# EAGLE design CV_Makers_Oximeter_v0 (EAGLE 9.5.2)
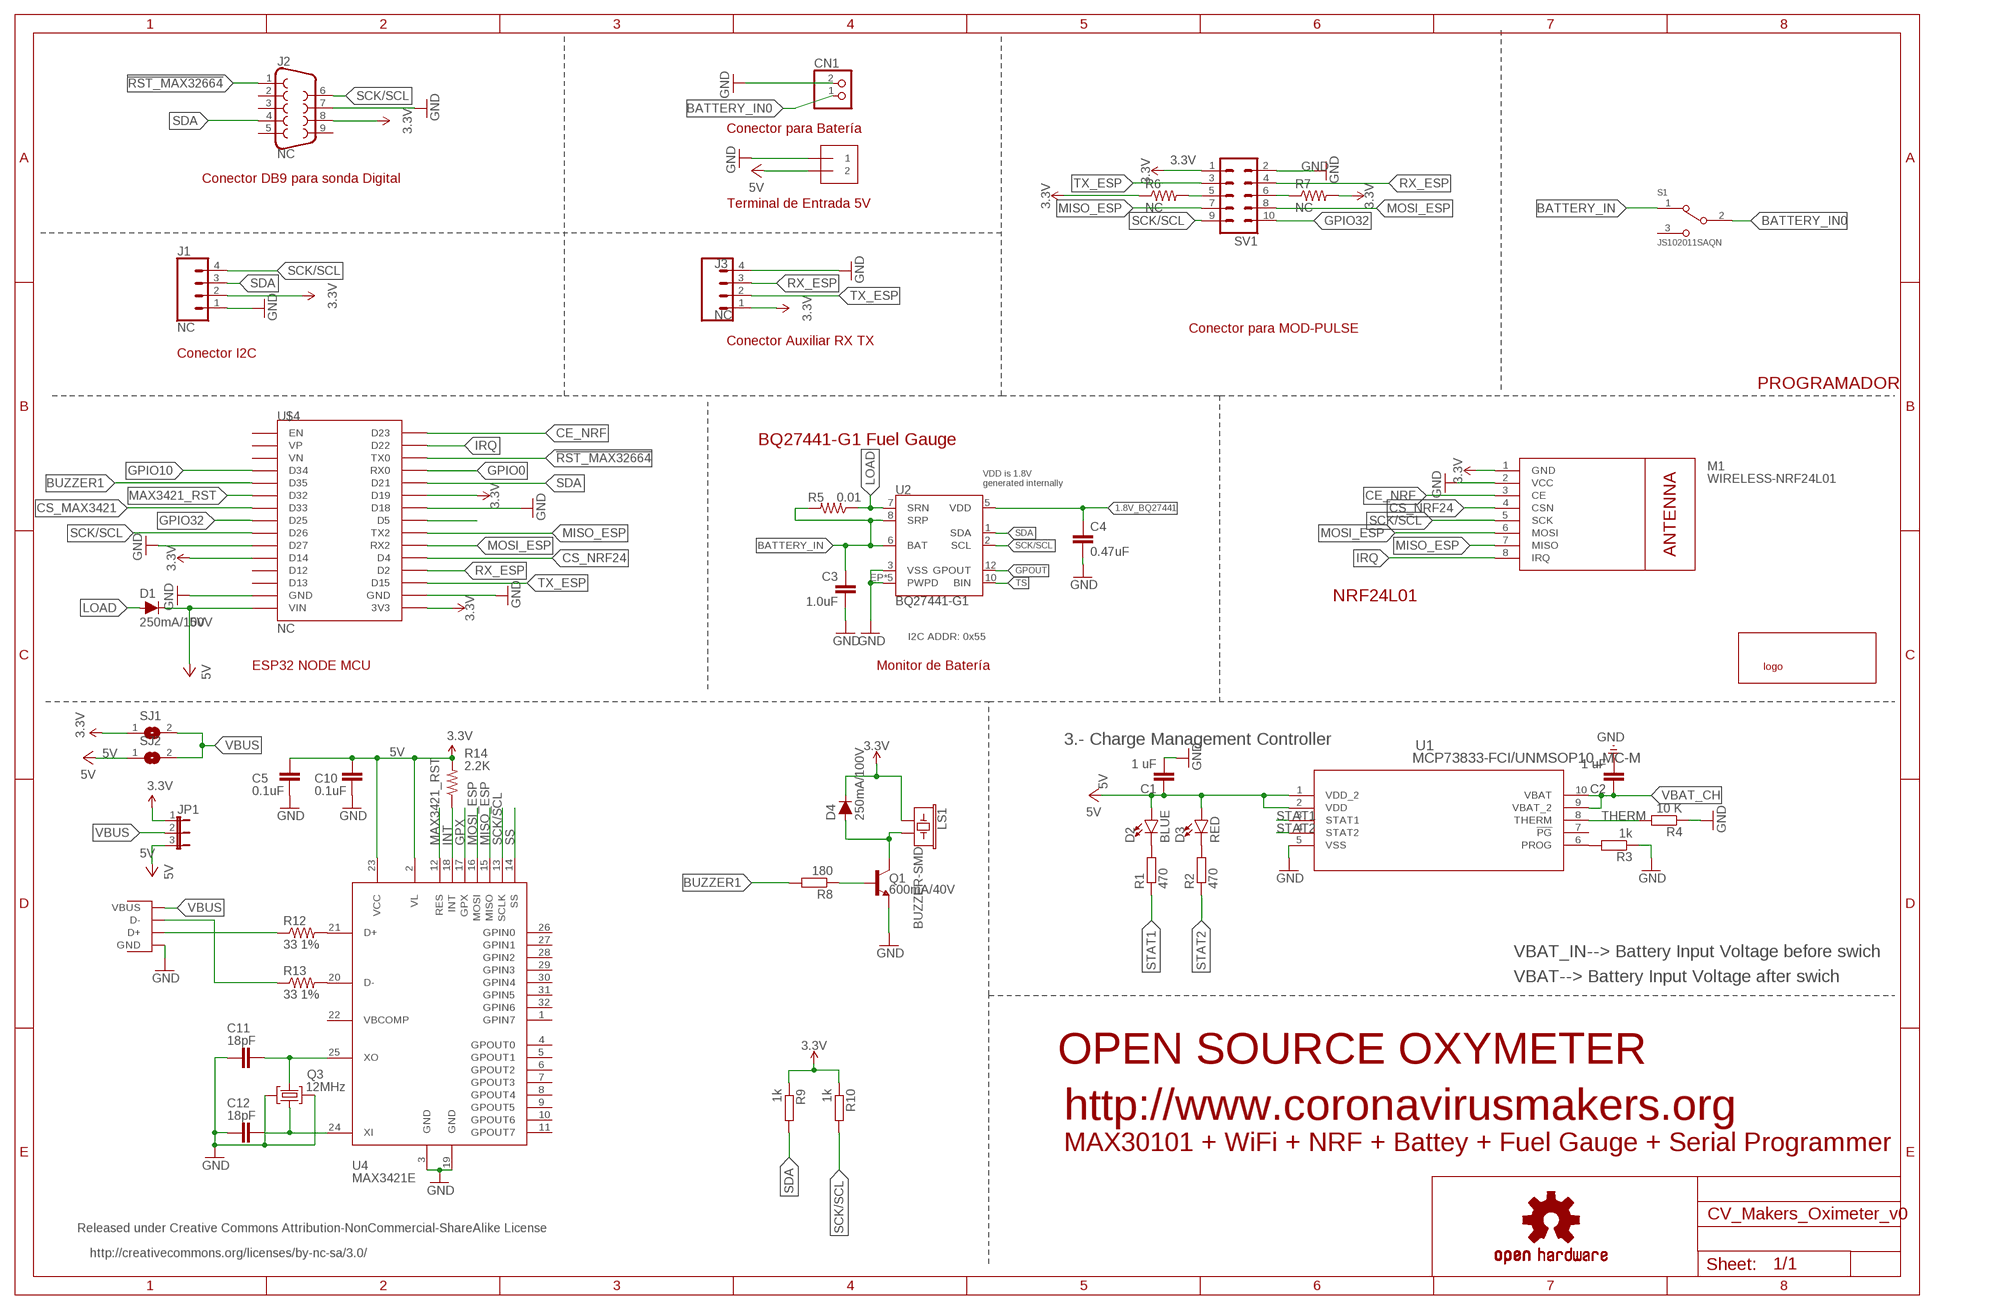
[diagram p0: schematic, sheet 1]

## Parts
C1  1 uF  C-EUC0603  [C0603]
C2  1 uF  C-EUC0603  [C0603]
C3  1.0uF  1.0UF-16V-10%(0603)  [0603-CAP]
C4  0.47uF  CAP0603-CAP  [0603-CAP]
C5  0.1uF  CAP0603  [0603]
C10  0.1uF  CAP0603  [0603]
C11  18pF  CAP0603  [0603]
C12  18pF  CAP0603  [0603]
CN1  JST_2PIN-THM-RA  [JST-PH-2-THM-RA]
D1  250mA/100V  DIODE-BAS16J  [SOD-323]
D2  BLUE  LED-BLUE0603  [LED-0603]
D3  RED  LED-RED0603  [LED-0603]
D4  250mA/100V  DIODE-BAS16J  [SOD-323]
J1  NC  CONN_04  [1X04]
J2  NC  DB9FEMALE  [DB9]
J3  NC  CONN_04  [1X04]
J4  NC  1X2-3.5MM  [1X2-3.5MM]
JP1  JP2E  [JP2]
LOGO1  OSHW-LOGOL-COPPER  [OSHW-LOGO-L_COPPER]
LS1  BUZZER-SMD  [BUZZER-CCV]
M1  WIRELESS-NRF24L01  [WIRELESS-NRF24L01]
Q1  600mA/40V  TRANS_NPN-MMBT2222AL  [SOT23-3]
Q3  12MHz  CRYSTAL_SH  [CRYSTAL-SMD-5X3]
R1  470  R-EU_R0603  [R0603]
R2  470  R-EU_R0603  [R0603]
R3  1k  R-EU_R0603  [R0603]
R4  10 K  R-EU_R0603  [R0603]
R5  0.01  RESISTOR1206  [1206]
R6  NC  R-US_R0603  [R0603]
R7  NC  R-US_R0603  [R0603]
R8  180  R-EU_R0603  [R0603]
R9  1k  R-EU_R0603  [R0603]
R10  1k  R-EU_R0603  [R0603]
R12  33 1%  RESISTOR0603  [0603]
R13  33 1%  RESISTOR0603  [0603]
R14  2.2K  RESISTOR0603  [0603]
S1  JS102011SAQN  [SW_JS102011SAQN]
SJ1  SJ  [SJ]
SJ2  SJ  [SJ]
SV1  ML10  [ML10]
U1  MCP73833-FCI/UNMSOP10_MC-M  [MSOP10_MC-M]
U2  BQ27441-G1  [PDSO-N12]
U4  MAX3421E  [TQFP32_8MIL]
U$2  LOGOEU  [LOGO2]
U$4  NC  ESP32_DEVKIT  [ESP32_DEVKIT]
X2  USB-A-H  [USB-A-H]

## Nets
1.8V_BQ27441: C4.1 U2.5(VDD)
3.3V: D4.C J1.2 J2.8 J3.1 JP1.1 LS1.+ M1.1(GND) R6.1 R7.2 R9.1 R10.1 SJ1.1 SV1.1 U$4.D14 U$4.D19
5V [VCC]: C1.1 C5.1 C10.1 D1.C D2.A D3.A J4.2 JP1.3 R14.2 SJ2.1 U1.1(VDD_2) U1.2(VDD) U4.2(VL) U4.23(VCC) U$4.VIN ; supply symbol labelled 3.3V
!RST_MAX32664: J2.1 U$4.TX0
BATTERY_IN: C3.1 R5.2 S1.1 U2.6(BAT) U2.8(SRP)
BATTERY_IN0: CN1.1 S1.2
BUZZER1: R8.2 U$4.D35
CE_NRF: M1.3(CE) U$4.D23
CS_MAX3421: U$4.D33
CS_NRF24: M1.4(CSN) U$4.D4
GND [GND]: C1.2 C2.2 C3.2 C4.2 C5.2 C10.2 C11.1 C12.1 CN1.2 J1.1 J2.7 J3.4 J4.1 M1.2(VCC) Q1.2(E) Q3.2 Q3.4 R3.1 R4.1 SV1.2 U1.5(VSS) U2.3(VSS) U2.EP1(PWPD) U2.EP2(PWPD) U2.EP3(PWPD) U2.EP4(PWPD) U2.EP(PWPD) U4.3(GND) U4.19(GND) U$4.D18 U$4.GND@1(GND) X2.GND
GPIO0: U$4.RX0
GPIO10: U$4.D34
GPIO32: SV1.10 U$4.D25
GPOUT: U2.12(GPOUT)
GPX: U4.17(GPX)
INT: R14.1 U4.18(INT)
IRQ: M1.8(IRQ) U$4.D22
LOAD: D1.A R5.1 U2.7(SRN)
MAX3421_RST: U4.12(RES) U$4.D32
MISO_ESP: M1.7(MISO) SV1.7 U4.15(MISO) U$4.TX2
MOSI_ESP: M1.6(MOSI) SV1.8 U4.16(MOSI) U$4.RX2
N$1: U$4.3V3 ; supply symbol labelled 3.3V
N$2: R6.2 SV1.5
N$3: R7.1 SV1.6
N$4: U$4.D27 ; supply symbol labelled GND
N$5: U$4.GND@2(GND) ; supply symbol labelled GND
N$6: Q1.1(B) R8.1
N$7: D4.A LS1.- Q1.3(C)
N$9: U$4.D5
N$10: R12.2 U4.21(D+)
N$11: D3.C R2.2
N$12: R13.2 U4.20(D-)
N$14: D2.C R1.2
N$15: R3.2 U1.6(PROG)
N$17: C11.2 Q3.3 U4.25(XO)
N$18: C12.2 Q3.1 U4.24(XI)
N$19: R12.1 X2.D+
N$20: R13.1 X2.D-
RX_ESP: J3.3 SV1.4 U$4.D2
SCK/SCL: J1.4 J2.6 M1.5(SCK) R10.2 SV1.9 U2.2(SCL) U4.13(SCLK) U$4.D26
SDA: J1.3 J2.4 R9.2 U2.1(SDA) U$4.D21
SS: U4.14(SS)
STAT1: R1.1 U1.3(STAT1)
STAT2: R2.1 U1.4(STAT2)
THERM: R4.2 U1.8(THERM)
TS: U2.10(BIN)
TX_ESP: J3.2 SV1.3 U$4.D15
VBAT_CH: C2.1 U1.9(VBAT_2) U1.10(VBAT)
VBUS: JP1.2 SJ1.2 SJ2.2 X2.VBUS
Unconnected: J2.2 J2.3 J2.5 J2.9 S1.3 U1.7(!PG) U4.1(GPIN7) U4.4(GPOUT0) U4.5(GPOUT1) U4.6(GPOUT2) U4.7(GPOUT3) U4.8(GPOUT4) U4.9(GPOUT5) U4.10(GPOUT6) U4.11(GPOUT7) U4.22(VBCOMP) U4.26(GPIN0) U4.27(GPIN1) U4.28(GPIN2) U4.29(GPIN3) U4.30(GPIN4) U4.31(GPIN5) U4.32(GPIN6) U$4.D12 U$4.D13 U$4.EN U$4.VN U$4.VP

## Notes on the sheet
- Conector para Batería
- Conector DB9 para sonda Digital
- Terminal de Entrada 5V
- Conector para MOD-PULSE
- Conector Auxiliar RX TX
- Conector I2C
- PROGRAMADOR
- BQ27441-G1 Fuel Gauge
- VDD is 1.8V
  generated internally
- NRF24L01
- I2C ADDR: 0x55
- ESP32 NODE MCU | Monitor de Batería
- 3.- Charge Management Controller
- VBAT_IN--> Battery Input Voltage before swich
- VBAT--> Battery Input Voltage after swich
- OPEN SOURCE OXYMETER
- http://www.coronavirusmakers.org
- MAX30101 + WiFi + NRF + Battey + Fuel Gauge + Serial Programmer
- Released under Creative Commons Attribution-NonCommercial-ShareAlike License
- http://creativecommons.org/licenses/by-nc-sa/3.0/

## Library data of the parts
C1 C2 = rcl:C-EU: CAPACITOR, European symbol
C3 = SparkFun-Capacitors:1.0UF-16V-10%(0603): CAP-00868; PROD_ID: CAP-00868
C4 = SparkFun-Capacitors:CAP: Capacitor Standard 0603 ceramic capacitor, and 0.1" leaded capacitor.; PROD_ID: CAP-13216
C5 C10-C12 = CH_passive:CAP: Capacitor Standard 0603 ceramic capacitor, and 0.1" leaded capacitor.
CN1 = adafruit:JST_2PIN: JST 2-Pin Connectors of various flavors SMT-RA (S2B-PH-SM4) 4UConnector #17311 SMT (B2B-PH-SM4) THM-RA (S2B-PH) THM (B2B-PH)
D1 D4 = SparkFun-DiscreteSemi:DIODE: Diode These are standard reverse protection diodes and small signal diodes. SparkFun Products: SparkFun SparkPunk Sound Kit <https://www.sparkfun.com/products/11177> SparkFun ESP8266 Thing <https://www.sparkfun.com/products/13231>; PROD_ID: DIO-09646
D2 = SparkFun-LED:LED-BLUE: Blue SMD LED Used in manufacturing of various products at SparkFun Packages: 0603 - SMD 0603 package [Product Link] <http://www.digikey.com/product-detail/en/SMLE12BC7TT86/511-1589-2-ND/1641808> 1206 - SMD1206 package [Product Link] <http://www.digikey.com/product-detail/en/lite-on-inc/LTST-C150TBKT/160-1643-1-ND/573584> SparkFun Products: ESP8266 Thing-Dev Board <https://www.sparkfun.com/products/13711> RedBoard <https://www.sparkfun.com/products/12757>; PROD_ID: DIO-08575
D3 = SparkFun-LED:LED-RED: Red SMD LED Used in manufacturing of most products at SparkFun Packages: 0603 - SMD 0603 package [Product Link] <http://docs.avagotech.com/docs/AV02-0551EN> 0603 SMART - SMD 0603 SMART package ( more efficient and expensive)[Product Link] <http://www.osram-os.com/Graphics/XPic2/00077099_0.pdf> 1206 - SMD1206 package [Product Link] <https://www.sparkfun.com/datasheets/DevTools/LilyPad/Q150OVS4.pdff> SparkFun Products: Pro Mini 328 -5V <https://www.sparkfun.com/products/821> RedBoard <https://www.sparkfun.com/products/12757> IOIO-OTG <https://www.sparkfun.com/products/13613>; PROD_ID: DIO-00819
J1 J3 = SparkFun-Connectors:CONN_04: Multi connection point. Often used as Generic Header-pin footprint for 0.1 inch spaced/style header connections On any of the 0.1 inch spaced packages, you can populate with these: Break Away Headers - Straight <https://www.sparkfun.com/products/116> (PRT-00116) Break Away Male Headers - Right Angle <https://www.sparkfun.com/products/553> (PRT-00553) Female Headers <https://www.sparkfun.com/products/115> (PRT-00115) Break Away Headers - Machine Pin <https://www.sparkfun.com/products/117> (PRT-00117) Break Away Female Headers - Swiss Machine Pin <https://www.sparkfun.com/products/743> (PRT-00743) For SCREWTERMINALS and SPRING TERMINALS visit here: Screw Terimnals on SparkFun.com <https://www.sparkfun.com/search/results?term=Screw+Terminals> (5mm/3.5mm/2.54mm spacing) This device is also useful as a general connection point to wire up your design to another part of your project. Our various solder wires solder well into these plated through hole pads. Hook-Up Wire - Assortment (Stranded, 22 AWG) <https://www.sparkfun.com/products/11375> (PRT-11375) Hook-Up Wire - Assortment (Solid Core, 22 AWG) <https://www.sparkfun.com/products/11367> (PRT-11367) View the entire wire category on our website here <https://www.sparkfun.com/categories/141> Special notes: Molex polarized connector foot print use with SKU : PRT-08231 with associated crimp pins and housings. 1MM SMD Version SKU: PRT-10208; PROD_ID: CONN-09696
J2 = SparkFun-Connectors:DB9: DB9 Connector Standard DB9 (D-Sub 9) serial connector. Can be used for CAN bus as well as RS485 and RS232. Footprint production proven. Here is the female version connector we sell at SparkFun: 9 Pin Female Serial Connector - PCB Mount <https://www.sparkfun.com/products/429> (PRT-00429) This connector has been used on the following SparkFun products: SparkFun RS232 Shifter - SMD <https://www.sparkfun.com/products/449> (PRT-00449) SparkFun RS232 Shifter SMD (No DB9) <https://www.sparkfun.com/products/8780> (PRT-08780); PROD_ID: CONN-08194
J4 = adafruit:1X2: 3.5mm Terminal block http://www.ladyada.net/library/pcb/eaglelibrary.html
JP1 = jumper:JP2E: JUMPER
LOGO1 = SparkFun-Aesthetics:OSHW-LOGO: Open-Source Hardware (OSHW) Logo This logo indicates the piece of hardware it is found on incorporates a OSHW license and/or adheres to the definition of open source hardware found here: http://freedomdefined.org/OSHW
LS1 = SparkFun-Electromechanical:BUZZER: Buzzer Small round buzzers that operate around the audible 2kHz range. You can use these as speakers to create simple music or user interfaces. Variant Overview: PTH - Mini Speaker - PC Mount 12mm 2.048kHz <https://www.sparkfun.com/products/7950> PTH_KIT - Mini Speaker - PC Mount 12mm 2.048kHz <https://www.sparkfun.com/products/7950> KIT simplifies soldering by adding stop mask to one side of the pads. PTH_NO_SILK - Mini Speaker - PC Mount 12mm 2.048kHz <https://www.sparkfun.com/products/7950> No silkscreen indicator of buzzer outline. PTH_KIT_NO_SILK - Mini Speaker - PC Mount 12mm 2.048kHz <https://www.sparkfun.com/products/7950> KIT package w/o silkscreen SMD - Buzzer Audio Magnetic (CCV-084B16) SMD buzzer used on, e.g. the LilyPad Buzzer <https://www.sparkfun.com/products/8463> and RFID USB Reader <https://www.sparkfun.com/products/9963>. SMD_KIT - Buzzer Audio Magnetic (CCV-084B16) SMD Buzzer with elongated pins to make soldering easier. Used on the SparkFun Simon Says - Surface Mount Soldering Kit <https://www.sparkfun.com/products/10935>.; PROD_ID: COMP-08568
M1 = diy-modules:WIRELESS-NRF24L01: 2.4 GHz Wireless Module based on NRF24L01 chip More details available here: http://www.electrodragon.com/w/NRF24L01 Click here to find device on ebay.com <http://www.ebay.com/sch/nrf24l01+arduino>
Q1 = SparkFun-DiscreteSemi:TRANS_NPN: NPN transistor Current controlled devices typically used to amplify current or used as a switch. BC547 - COM-08928 <http://www.sparkfun.com/products/8928> (TO-92 45V 100mA) (1.Collector 2.Base 3.Emitter) 2N3904 - COM-00521 <http://www.sparkfun.com/products/521> (TO-92 40V 200mA) (1.Emitter 2.Base 3.Collector) P2N2222A - COM-12852 <http://www.sparkfun.com/products/12852> (TO-92 40V 600mA) (1.Collector 2.Base 3.Emitter); PROD_ID: TRANS-08049
Q3 = CH_passive:CRYSTAL_SH
R1-R4 R8-R10 = rcl:R-EU_: RESISTOR, European symbol
R5 = SparkFun-Resistors:RESISTOR: Generic Resistor Package; PROD_ID: RES-13218
R6 R7 = adafruit:R-US_: RESISTOR, American symbol
R12-R14 = CH_passive:RESISTOR: Resistor Basic schematic elements and footprints for 0603, 1206, and PTH 1/10th watt (small) resistors.
S1 = TFM:JS102011SAQN: JS10 Series SPDT On-On 6 V 0.3 A Gull Wing SMT Slide Switch http://www.snapeda.com/parts/JS102011SAQN/C%26K%20Components/view-part/; AVAILABILITY: Good; DESCRIPTION: JS10 Series SPDT On-On 6 V 0.3 A Gull Wing SMT Slide Switch; MF: C&K Components; MP: JS102011SAQN; PACKAGE: None; PRICE: 0.37 USD
SJ1 SJ2 = jumper:SJ: SMD solder JUMPER
SV1 = con-harting-ml:ML10: HARTING
U1 = TFM:MCP73833-FCI/UN; MANUFACTURER_PART_NUMBER: MCP73833FCIUN; VENDOR: Microchip
U2 = battery-management-temp:BQ27441-G1; PROD_ID: IC-13220
U4 = CH_Maxim:MAX3421E
U$2 = Oxymeter:LOGOEU
U$4 = DOIT_ESP32_DEVKIT:ESP32_DEVKIT: ESP32 DEVKIT BOARD
X2 = CH_connectors:USB: USB Connectors USB-B-PTH is C@H proven USB-A-H is C@H proven

## Net classes
0 default: width 0.254 mm
1 GND: width 0.254 mm
2 VCC: width 0.406 mm

## Board
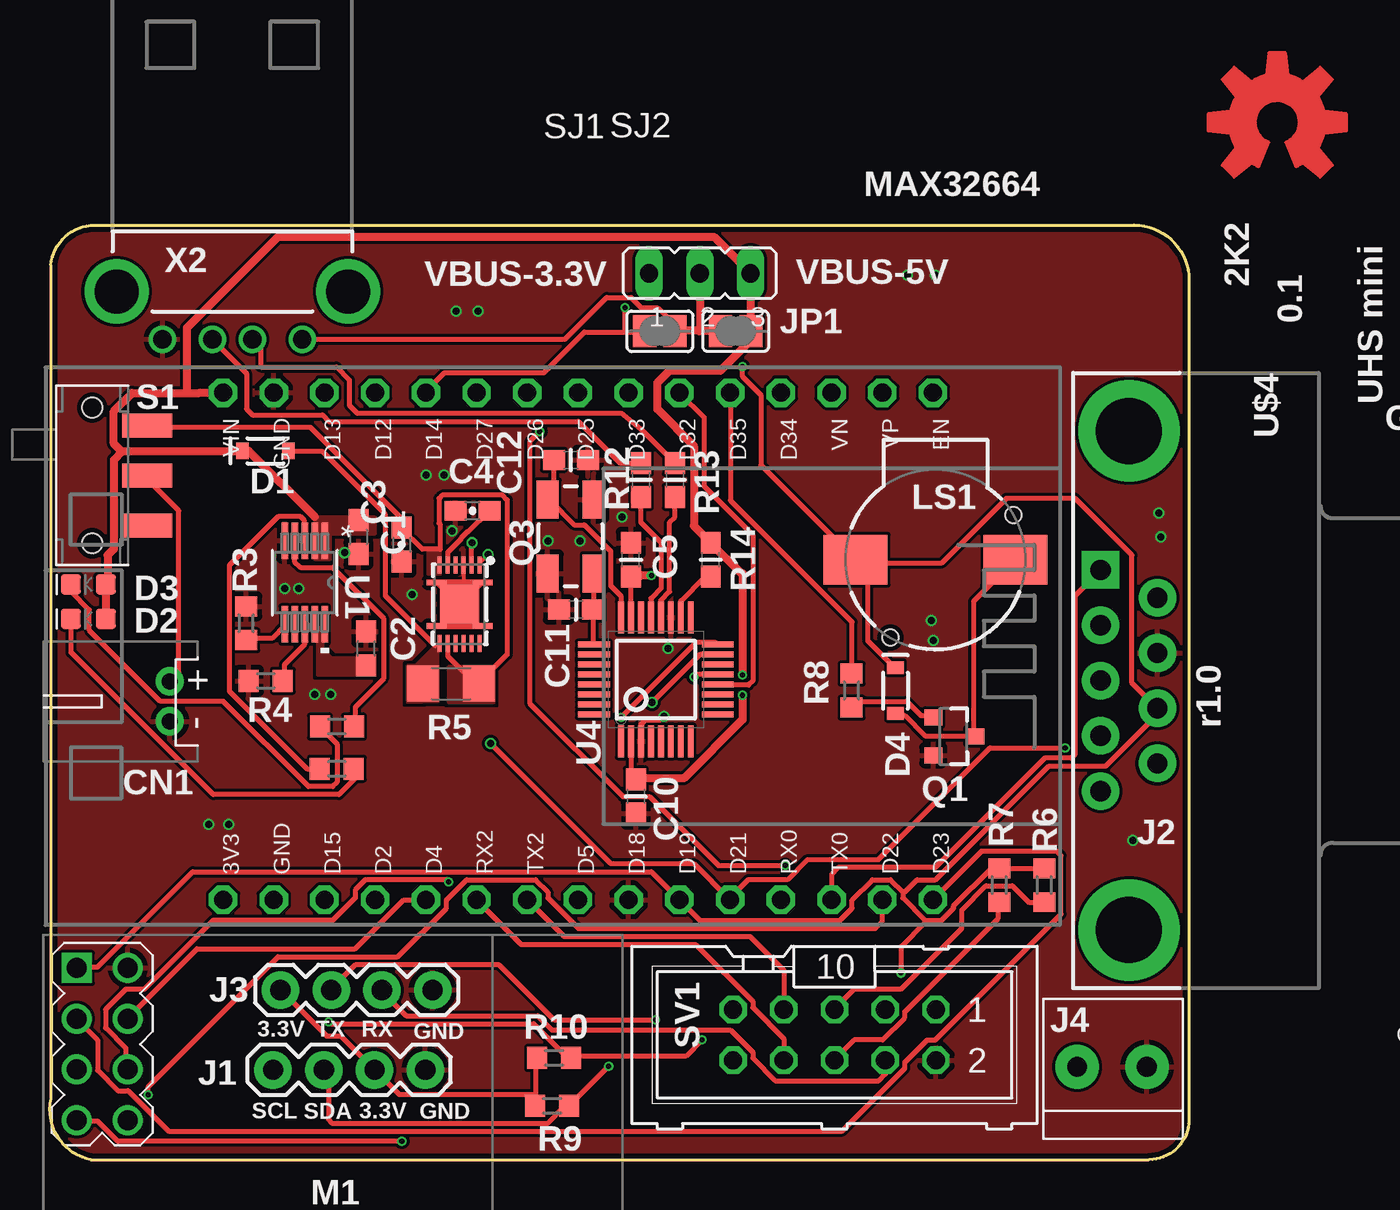
[diagram p1: board, top side]
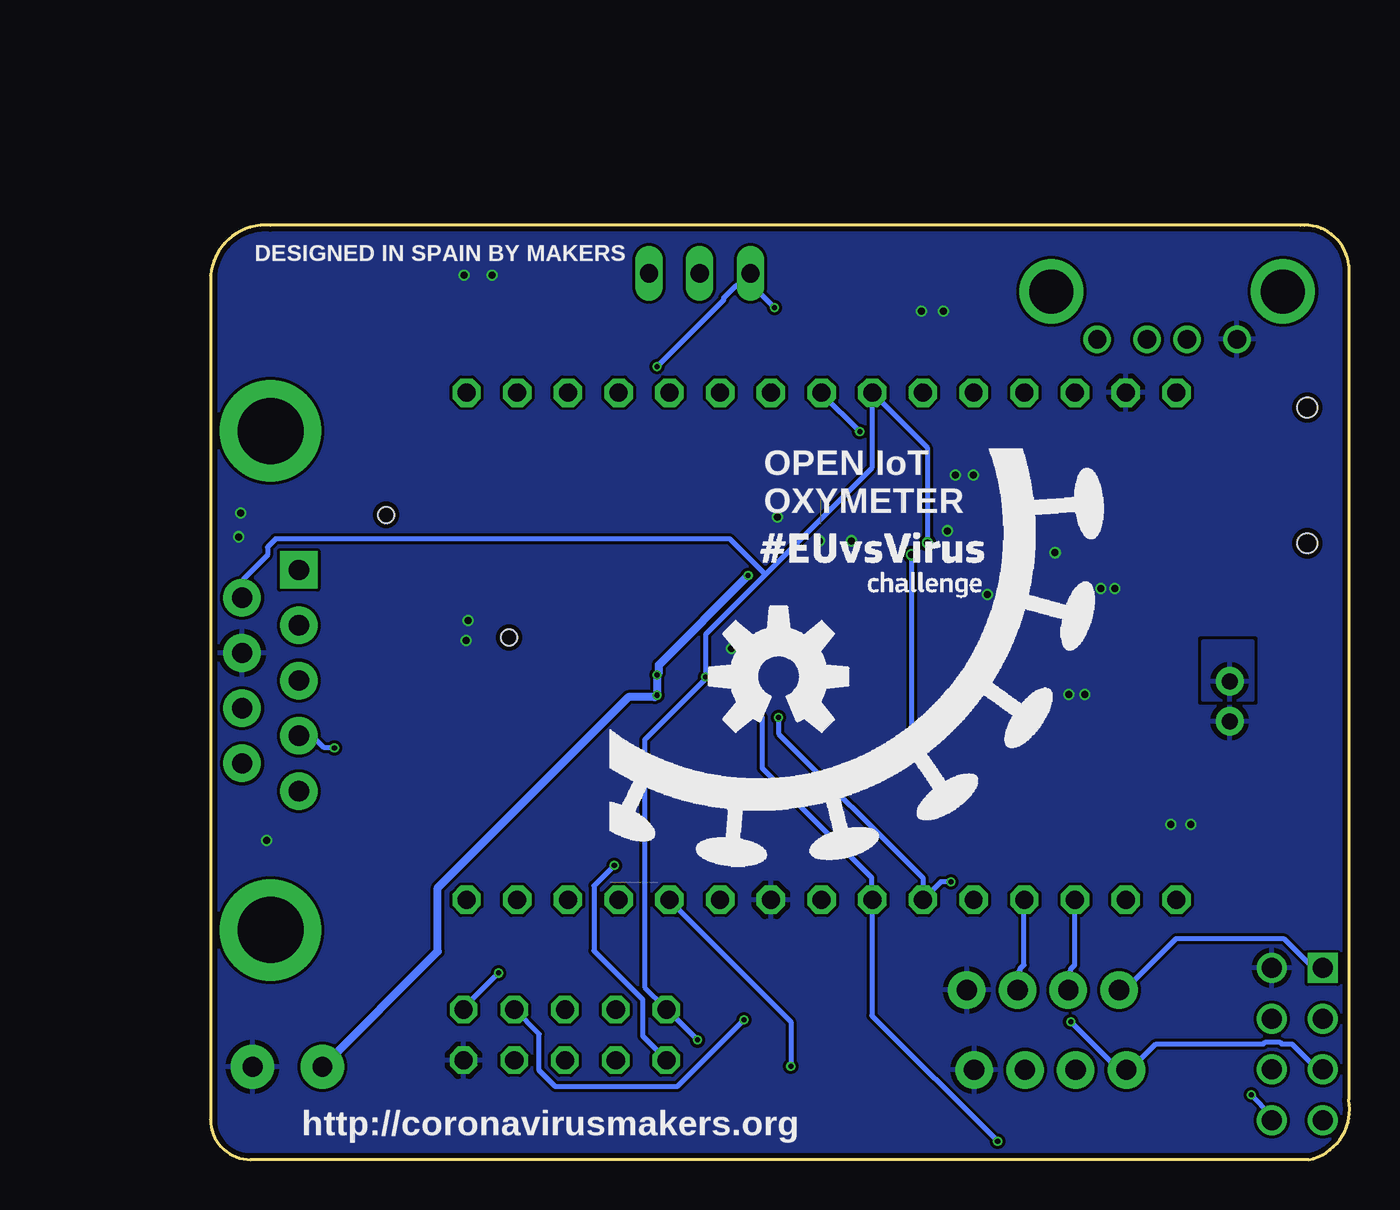
[diagram p2: board, bottom side, seen from below]

Size 57.05 x 46.81 mm. Coordinates in mm from the lower left corner, seen from the top.
Outline: 0.05,44.8 0.05,3 arc90 2.05,0 55.05,0 arc90 57.05,2 57.05,44.3 arc90 54.05,46.8 2.45,46.8 arc90 0.05,44.8
Copper layers (1*16): Top 0.035mm / dielectric 1.5mm / Bottom 0.035mm
Design rules "SeeedStudio_4layer_DRU_no_angle_20140221 *": minimum track width 1mil, minimum drill 10mil, track to track 6mil, track to pad 6mil, pad to pad 6mil, via to via 6mil, smd to smd 0mil, copper to edge 10mil, drill to drill 8mil, minimum pad ring 4mil, minimum via ring 4mil, stop-mask expansion 4mil, vias tented up to drill 25mil, thermal gap 10mil
tRestrict: 2 lines
bRestrict: 2 lines

### Footprints (pad centres in the part's own frame; a part is rotated, then mirrored left to right if it is on the bottom)
C0603 = smd 1.1 x 1: 1 -0.85,0; 2 0.85,0
0603-CAP = smd 1.1 x 1: 1 -0.85,0; 2 0.85,0
0603 = smd 1.1 x 1: 1 -0.85,0; 2 0.85,0
JST-PH-2-THM-RA = drill 0.8 pad 1.422: 1 1,0; 2 -1,0
SOD-323 = smd 0.63 x 0.83: A 1.15,0; C -1.15,0
LED-0603 = smd 1 x 1: A -0.877,0; C 0.877,0
1X04 = drill 1.016 pad 1.88: 1 0,0; 2 2.54,0; 3 5.08,0; 4 7.62,0
DB9 = drill 1.016 pad 1.88 square: 1 -5.54,-1.42 | drill 1.016 pad 1.88: 2 -2.77,-1.42; 3 0,-1.42; 4 2.77,-1.42; 5 5.54,-1.42; 6 -4.15,1.42; 7 -1.38,1.42; 8 1.38,1.42; 9 4.15,1.42 | drill 3.302 pad 5.08: G1 -12.5,0; G2 12.5,0
1X2-3.5MM = drill 1 pad 2.184: 1 1.8,0; 2 -1.7,0
JP2 = drill 0.914 long: 1 -2.54,0; 2 0,0; 3 2.54,0
BUZZER-CCV = smd 3.2 x 2.5: + 4,0; - -4,0 | hole 0.8: -3.9,-2.25; 2.25,3.9
WIRELESS-NRF24L01 = drill 1 square: 1 -12.7,6.35 | drill 1: 2 -10.16,6.35; 3 -12.7,3.81; 4 -10.16,3.81; 5 -12.7,1.27; 6 -10.16,1.27; 7 -12.7,-1.27; 8 -10.16,-1.27
SOT23-3 = smd 0.8 x 0.9: 1 -0.95,-1; 2 0.95,-1; 3 0,1.1
CRYSTAL-SMD-5X3 = smd 1.9 x 1.1: 1 -1.85,-1.15; 2 1.85,-1.15; 3 1.85,1.15; 4 -1.85,1.15
R0603 = smd 1 x 1.1: 1 -0.85,0; 2 0.85,0
1206 = smd 1.6 x 1.8: 1 -1.4,0; 2 1.4,0
SW_JS102011SAQN = smd 1.2 x 2.5: 1 -2.5,2.75; 2 0,2.75; 3 2.5,2.75 | hole 1: -3.4,0; 3.4,0
SJ = smd 1.168 x 1.6: 1 -0.762,0; 2 0.762,0
ML10 = drill 0.914 octagon: 1 -5.08,-1.27; 2 -5.08,1.27; 3 -2.54,-1.27; 4 -2.54,1.27; 5 0,-1.27; 6 0,1.27; 7 2.54,-1.27; 8 2.54,1.27; 9 5.08,-1.27; 10 5.08,1.27
MSOP10_MC-M = smd 1.829 x 0.33: 1 -2.095,1; 2 -2.095,0.5; 3 -2.095,0; 4 -2.095,-0.5; 5 -2.095,-1; 6 2.095,-1; 7 2.095,-0.5; 8 2.095,0; 9 2.095,0.5; 10 2.095,1
PDSO-N12 = smd 0.2 x 0.85: 1 -1,-1.975; 2 -0.6,-1.975; 3 -0.2,-1.975; 4 0.2,-1.975; 5 0.6,-1.975; 6 1,-1.975; 7 1,1.975; 8 0.6,1.975; 9 0.2,1.975; 10 -0.2,1.975; 11 -0.6,1.975; 12 -1,1.975 | smd 1.95 x 1.95: EP 0,0 | smd 1 x 0.25: EP1 -1.15,1.1; EP2 -1.15,-1.1; EP3 1.15,-1.1; EP4 1.15,1.1
TQFP32_8MIL = smd 0.294 x 1.6: 1 -1.75,-3.1; 2 -1.25,-3.1; 3 -0.75,-3.1; 4 -0.25,-3.1; 5 0.25,-3.1; 6 0.75,-3.1; 7 1.25,-3.1; 8 1.75,-3.1; 17 1.75,3.1; 18 1.25,3.1; 19 0.75,3.1; 20 0.25,3.1; 21 -0.25,3.1; 22 -0.75,3.1; 23 -1.25,3.1; 24 -1.75,3.1 | smd 1.6 x 0.294: 9 3.1,-1.75; 10 3.1,-1.25; 11 3.1,-0.75; 12 3.1,-0.25; 13 3.1,0.25; 14 3.1,0.75; 15 3.1,1.25; 16 3.1,1.75; 25 -3.1,1.75; 26 -3.1,1.25; 27 -3.1,0.75; 28 -3.1,0.25; 29 -3.1,-0.25; 30 -3.1,-0.75; 31 -3.1,-1.25; 32 -3.1,-1.75
ESP32_DEVKIT = drill 0.9 pad 1.422 octagon: 3V3 11.43,-17.78; D2 11.43,-10.16; D4 11.43,-7.62; D5 11.43,0; D12 -13.97,-10.16; D13 -13.97,-12.7; D14 -13.97,-7.62; D15 11.43,-12.7; D18 11.43,2.54; D19 11.43,5.08; D21 11.43,7.62; D22 11.43,15.24; D23 11.43,17.78; D25 -13.97,0; D26 -13.97,-2.54; D27 -13.97,-5.08; D32 -13.97,5.08; D33 -13.97,2.54; D34 -13.97,10.16; D35 -13.97,7.62; EN -13.97,17.78; GND@1 -13.97,-15.24; GND@2 11.43,-15.24; RX0 11.43,10.16; RX2 11.43,-5.08; TX0 11.43,12.7; TX2 11.43,-2.54; VIN -13.97,-17.78; VN -13.97,12.7; VP -13.97,15.24
USB-A-H = drill 0.914: D+ 2.4,-1; D- 2.4,1; GND 2.4,-3.5; VBUS 2.4,3.5 | drill 2.2: GND@1 0,5.8; GND@2 0,-5.8

### Placement (x,y rotation side)
C1  15.45,31.19 270 top
C2  15.85,25.6 90 top
C3  17.61,30.81 270 top
C4  21.16,32.5 180 top
C5  29.1,30.05 90 top
C10  29.35,18.19 270 top
C11  26.35,27.55 0 top
C12  26.1,35.05 180 top
CN1  6,22.96 90 top
D1  10.8,35.5 0 top
D2  1.92,27.09 180 top
D3  1.92,28.82 180 top
D4  42.35,23.5 270 top
J1  18.8,4.5 180 top
J2  54.05,24 270 top
J3  11.55,8.5 0 top
J4  53.15,4.65 0 top
JP1  32.55,44.4 0 top
LOGO1  61.47,51.96 0 top  (outside the outline)
LS1  44.35,30.05 180 top
M1  14.05,3.25 0 top
Q1  45.25,21.2 270 top
Q3  26.08,31.22 270 top
R1  14.37,19.58 0 top
R2  14.38,21.7 180 top
R3  9.83,26.87 270 top
R4  10.81,23.98 0 top
R5  20.09,23.84 0 top
R6  49.8,13.75 270 top
R7  47.55,13.75 90 top
R8  40.15,23.5 90 top
R9  25.15,2.7 0 top
R10  25.25,5.1 0 top
R12  29.6,34.05 270 top
R13  31.3,34.05 270 top
R14  33.1,30.05 90 top
S1  2.12,34.27 270 top
SJ1  30.55,41.5 0 top
SJ2  34.35,41.5 180 top
SV1  39.3,6.25 180 top
U1  12.77,28.91 270 top
U2  20.52,27.82 180 top
U4  30.35,24.05 0 top
U$1  [OSHW-LOGO-L]  28.6,24.2 0 bottom
U$2  37.05,14 0 bottom
U$4  26.45,24.45 270 top
X2  9.14,43.49 270 top

### Tracks (layer width: path | path; a pad name or v marks a point on that pad's centre or on a via)
1.8V_BQ27441
  Top 0.254: C4.1 20.97,31.46 20.92,31.46 20.59,31.13 20.59,31.08 19.93,30.42 19.92,30.41 U2.5
3.3V  (via drill 0.25)
  Top 0.254: R10.1 24.33,5.08 24.33,3.25 24.25,3.25 | 28.8,41.45 26.77,41.45 24.74,39.42 19.76,39.42 18.85,38.51 U$4.D14 | 28.8,41.45 29.72,41.45 SJ1.1 | 28.8,41.45 v28.8,42.67 | 43.84,11.99 44.65,11.99 45.26,12.6 45.26,12.7 47.16,14.6 R7.2 R6.1 | 43.84,11.99 42.72,13.11 42.72,13.41 | 42.72,13.41 42.11,14.02 41.2,14.02 40.18,13.01 40.18,12.6 39.57,11.99 32.56,11.99 U$4.D19 30.12,14.43 7.16,14.43 2.39,9.65 1.4,9.65 M1.1 | v42.62,9.35 42.62,10.67 43.84,11.89 43.84,11.99 | 42.72,13.41 42.82,13.41 43.43,14.02 44.35,14.02 50.04,19.71 52.88,19.71 55.42,22.25 55.42,22.55 J2.8 55.42,22.66 54.2,23.88 54.2,30.28 51.36,33.12 47.9,33.12 44.65,29.87 40.53,29.87 LS1.+ | v34.7,39.73 34.7,39.22 35.61,38.3 35.61,34.79 LS1.+ | LS1.+ 40.95,29.45 40.95,26 42.3,24.65 D4.C | J3.1 13.85,6.2 14.56,6.2 J1.2 17.51,3.25 24.25,3.25 | R9.1 24.3,3.2 24.25,3.25
  Bottom 0.254: M1.1 1.37,9.65 1.88,9.65 3.3,11.07 8.69,11.07 10.82,8.94 11.12,8.94 11.53,8.53 J3.1 | v28.8,42.67 29.92,43.79 29.92,44.4 JP1.1 30.02,43.79 30.73,43.79 31.34,43.18 31.34,43.08 v34.7,39.73 | v42.62,9.35 44.35,7.62 SV1.1
5V  (via drill 0.25)
  Top 0.254: U4.23 C5.1 | U4.2 29.1,19.29
  Top 0.406: D2.A 2.79,27.13 2.79,28.75 D3.A 2.89,28.96 2.89,30.28 3.2,30.58 3.2,35.05 3.61,35.46 | 13.27,32.21 13.26,32.21 9.96,35.5 D1.C 9.61,35.46 3.61,35.46 | 6.86,38.41 4.11,38.41 3.2,37.49 3.2,35.87 3.61,35.46 | 6.86,38.41 7.48,38.41 7.57,38.42 U$4.VIN | v34.7,23.27 34.7,22.05 31.75,19.1 29.6,19.1 29.54,19.04 C10.1 29.1,19.29 | v34.7,24.28 34.7,29.36 34.64,29.36 R14.2 32.26,31.74 32.26,35.76 30.43,37.59 30.43,38.91 31.04,39.52 33.58,39.52 35.11,41.06 SJ2.1 35.09,41.52 JP1.3 33.26,46.23 11.43,46.23 6.86,41.66 6.86,38.41 | v30.12,29.26 29.53,29.26 29.52,29.2 C5.1
  Bottom 0.406: v30.12,29.26 34.59,24.79 34.59,24.38 v34.7,24.28 v34.7,23.27 34.8,23.16 36.12,23.16 45.67,13.61 45.67,10.43 J4.2
  pour Top (no thermals): 16.28,32.21 16.28,31.32 14.04,31.32 14.04,30.05 13.27,30.05 13.27,32.21
!RST_MAX32664
  Top 0.254: U$4.TX0 39.15,14.3 39.48,14.63 44.35,14.63 49.83,20.12 51.15,20.12 51.36,20.32 51.36,28.27 J2.1
BATTERY_IN
  Top 0.254: 19.56,30.58 19.55,30.6 | S1.1 4.93,36.68 13.05,36.68 17.52,32.21 17.52,31.7 C3.1 17.63,31.6 18.64,30.58 19.52,30.58 19.54,30.6 19.54,31.83 19.48,31.89 19.48,33.12 19.65,33.28 22.68,33.28 22.91,33.05 22.91,25.3 21.45,23.84 | U2.8 19.92,25.23 21.31,23.84 21.45,23.84 | 21.45,23.84 R5.2
  pour Top (no thermals): 19.95,24.7 19.95,22.9 22.25,22.9 22.25,24.7
  pour Top (no thermals): 19.55,30.6 19.55,29.3 18.95,29.3 18.95,30.6
BATTERY_IN0
  Top 0.254: S1.2 4.93,34.24 4.93,34.04 6.45,32.51 6.45,24.38 6.04,23.98 CN1.1
  pour Bottom (isolate 0.254): 4.85,26 4.85,23 7.35,23 7.35,26
BUZZER1
  Top 0.254: U$4.D35 34.09,38.41 34.09,33.02 40.18,26.93 40.18,24.79 40.15,24.76 R8.2
CE_NRF
  Top 0.254: M1.3 1.37,7.01 2.39,5.99 2.39,4.47 3.4,3.45 3.91,3.45 5.94,1.42 39.67,1.42 42.82,4.57 42.82,4.88 43.94,5.99 44.35,5.99 50.65,12.29 50.65,15.24 50.44,15.44 46.65,15.44 U$4.D23
CS_NRF24
  Top 0.254: U$4.D4 18.74,13.01 17.73,13.01 15.29,10.57 7.36,10.57 3.91,7.11 M1.4
GND  (via drill 0.35)
  Top 0.203: U2.3 20.72,27.99
  Top 0.254: 20.47,26.72 19.46,26.72 U2.EP4 | U2.EP3 19.46,28.85 20.47,27.84 U2.EP 20.57,27.84 21.59,28.85 U2.EP2 | 20.6,26.72 21.59,26.72 U2.EP1 | v30.75,22.2 30.58,22.03 29.84,22.03 29.6,21.79 U4.3
  Top 0.406: 20.72,27.99 20.57,27.84
  other vias: 18.85,34.3 19.75,34.3 7.95,16.8 8.95,16.8 20.35,42.5 21.45,42.5 42.95,44.3 44.35,44.3 55.55,32.4 55.65,31.2 44.15,27 44.25,26 54.25,16 14.75,30.4 18.15,28.3 28.65,32.2 11.75,28.6 12.45,28.6 13.25,23.3 14.05,23.3 30.95,25.6 20.15,31.5 24.95,31 26.55,31
  pour Top (rank 2): 59.3,48.75 -5.45,48.75 -5.45,-3.75 59.3,-3.75
  pour Bottom (rank 2): -4.7,49.36 58.55,49.6 58.55,-2.75 -4.7,-2.75
GPIO32  (via drill 0.25)
  Top 0.254: v36.83,14.73 33.48,14.73 30.02,18.19 28.7,18.19 24.03,22.86 24.03,35.97 v24.54,36.47
  Bottom 0.254: v36.83,14.73 37.84,13.72 37.84,10.46 35.41,8.03 35.41,6.2 34.29,5.08 SV1.10 | v24.54,36.47 26.47,38.41 U$4.D25
INT
  Top 0.254: R14.1 33.07,29.16 32.76,29.16 31.6,27.99 U4.18
IRQ  (via drill 0.25)
  Top 0.254: v4.93,3.25 4.93,3.66 11.43,10.16 17.42,10.16 19.86,12.6 19.86,13.01 20.88,14.02 24.33,14.02 24.94,13.41 24.94,13.11 26.47,11.58 41.33,11.58 41.69,11.94 U$4.D22
  Bottom 0.254: v4.93,3.25 3.91,2.23 3.91,2.03 M1.8
LOAD
  Top 0.254: 19.3,25.75 16.81,28.25 16.81,32.31 13.66,35.46 12.04,35.46 D1.A
  pour Top (no thermals): 17.9,22.9 19.45,22.95 19.45,25.9 18.3,24.75 17.9,24.75
MAX3421_RST
  Top 0.254: U$4.D32 31.55,38.41 32.76,37.19 32.76,33.73 35.2,31.29 35.2,23.98 35,23.77 33.48,23.77 U4.12
MISO_ESP  (via drill 0.25, 0.35)
  Top 0.254: U$4.TX2 23.93,13.01 25.75,11.18 35.07,11.18 36.76,9.49 SV1.7 | v17.63,0.91 3.4,0.91 2.39,1.93 1.37,1.93 M1.7 | U4.15 32.55,25.3 v30.15,22.9
  Bottom 0.254: v17.63,0.91 23.93,7.21 23.93,12.9 U$4.TX2 23.93,13.11 23.93,14.12 29.41,19.61 29.41,22.16 v30.15,22.9
MOSI_ESP  (via drill 0.25)
  Top 0.254: U$4.RX2 23.62,10.77 32.36,10.77 35.2,7.92 35.2,7.62 36.76,6.06 SV1.8 | v19.96,13.92 19.86,14.02 15.8,14.02 15.29,13.51 15.29,13.11 14.17,11.99 8.18,11.99 4.72,8.53 3.81,8.53 2.79,7.52 2.79,6.6 3.81,5.59 3.81,4.57 M1.6 | U4.16 33.35,25.9 32.35,25.9 v28.6,22.15
  Bottom 0.254: v28.6,22.15 28.6,21.34 21.37,14.11 U$4.RX2 20.47,13.92 v19.96,13.92
N$2
  Top 0.254: SV1.5 39.3,7.55 40.28,8.53 42.62,8.53 45.67,11.58 45.67,12.5 46.89,13.72 48.21,13.72 49.02,12.9 R6.2
N$3
  Top 0.254: R7.1 47.5,12.8 47.5,12.09 42.82,7.42 42.82,7.11 41.71,5.99 40.28,5.99 39.3,5.01 SV1.6
N$6
  Top 0.254: R8.1 40.15,22.82 40.29,22.96 42.92,22.96 43.64,22.25 44.25,22.25 Q1.1
N$7
  Top 0.254: D4.A 42.42,22.25 42.82,22.25 43.84,21.23 46.32,21.23 Q1.3 46.28,21.27 46.28,27.98 LS1.-
N$10
  Top 0.254: U4.21 30.1,28.12 30.63,28.65 30.63,30.89 29.6,31.92 R12.2
N$11
  Top 0.254: D3.C 1.07,28.75 1.07,28.45 1.98,27.53 1.98,26.52 5.54,22.96 8.69,22.96 12.95,18.69 14.17,18.69 14.38,18.9 14.38,20.83 13.53,21.68 R2.2
N$12
  Top 0.254: R13.2 31.3,32.2 31.04,31.94 31.04,28.45 30.6,28.01 U4.20
N$14
  Top 0.254: D2.C 1.07,27.03 1.07,25.4 8.18,18.29 14.48,18.29 15.5,19.31 R1.2 15.32,19.57
N$15
  Top 0.254: R3.2 10,26.02 10.07,26.11 11.12,26.11 11.77,26.75 U1.6
N$17
  Top 0.254: Q3.3 27.23,27.58 C11.2 27.2,25.85 U4.25
N$18
  Top 0.254: C12.2 25.25,34.95 25.25,33.43 24.94,33.12 Q3.1 25.04,33.02 26.26,31.8 26.77,31.8 28.09,30.48 28.09,28.75 28.6,28.24 U4.24
N$19
  Top 0.254: R12.1 28.55,34.9 26.47,36.98 13.97,36.98 13.65,37.3 10.15,37.3 9.85,37.6 9.85,39.38 X2.D+
N$20
  Top 0.254: R13.1 29.73,36.47 28.6,37.39 15.4,37.39 15,37.79 15,39.05 14.35,39.7 10.55,39.7 10.55,40.68 X2.D-
RX_ESP
  Top 0.254: J3.3 16.93,8.2 16.93,8.12 17.83,7.21 24.43,7.21 25.14,6.5 34.09,6.5 35.2,5.38 35.2,5.08 36.32,3.96 41.51,3.96 41.85,4.3 SV1.4
  Bottom 0.254: U$4.D2 16.31,13.01 16.31,9.75 16.51,9.55 16.51,9.45 16.61,9.35 16.61,8.52 J3.3
SCK/SCL  (via drill 0.25, 0.35)
  Top 0.254: v32.66,5.99 31.85,5.18 26.16,5.18 R10.2 26.06,5.18 25.86,5.18 24.23,6.81 14.07,6.81 v13.97,6.91 | U2.2 21.12,30.87 v21.15,30.9 | U4.13 32.38,24.3 v32.26,24.18
  Bottom 0.254: v32.66,5.99 34.19,7.52 SV1.9 34.29,7.62 35.3,8.64 35.3,21.03 32.26,24.08 v32.26,24.18 32.26,26.31 29.26,29.31 | M1.5 1.37,4.57 1.68,4.57 2.89,5.79 3.4,5.79 3.5,5.89 4.22,5.89 4.32,5.79 9.7,5.79 10.92,4.57 11.12,4.57 J1.4 11.23,4.57 11.63,4.57 v13.97,6.91 | 29.26,29.31 23.93,34.65 23.93,38.41 U$4.D26 21.15,35.66 v21.15,30.9 | 29.26,29.31 31.04,31.09 53.8,31.09 54.2,30.68 54.2,30.28 55.42,29.06 55.42,28.25 J2.6
SDA  (via drill 0.25, 0.35)
  Top 0.152: U2.1 21.52,29.87
  Top 0.2: 21.52,29.87 v21.95,30.3
  Top 0.254: v22.07,20.86 28.09,14.83 32.26,14.83 34.02,13.07 | v50.85,20.62 47.09,20.62 41.5,15.04 37.95,15.04 36.93,14.02 34.97,14.02 34.02,13.07 | v27.99,4.67 26.06,2.74 R9.2 25.96,2.64 25.75,2.64 24.94,1.83 14.12,1.83 13.95,2 13.95,4.27 J1.3 | 34.02,13.07 U$4.D21
  Bottom 0.254: v50.85,20.62 51.36,20.62 51.87,21.13 52.58,21.13 J2.4 | v27.99,4.67 27.99,6.91 34.09,13.01 U$4.D21 | v21.95,30.3 21.95,20.98 v22.07,20.86
STAT1
  Top 0.254: U1.3 12.75,31.02 12.75,32 12.55,32.21 11.43,32.21 8.99,29.77 8.99,23.47 12.88,19.58 R1.1
STAT2
  Top 0.254: R2.1 15.29,21.7 15.29,22.66 16.71,24.08 16.71,27.13 14.17,29.67 12.55,29.67 12.24,29.97 12.24,31 U1.4
THERM
  Top 0.254: R4.2 11.73,24.05 11.73,24.79 12.75,25.81 12.75,26.12 12.77,26.21 U1.8
TX_ESP  (via drill 0.25)
  Top 0.254: v30.33,7.01 25.25,7.01 22.5,9.75 15.29,9.75 14.09,8.55 J3.2
  Bottom 0.254: v30.33,7.01 33.68,3.66 39.78,3.66 40.59,4.47 40.59,6.3 41.81,7.52 SV1.3 | U$4.D15 13.77,13.01 13.77,9.75 13.97,9.55 13.97,9.45 14.07,9.35 14.07,8.53 J3.2
VBAT_CH
  Top 0.254: 13.37,26.75 13.33,26.74 U1.9 | 13.66,26.72 13.77,26.72 U1.10
  pour Top (no thermals): 16.21,25.12 14.14,25.12 13.68,25.58 13.68,26.65 13.37,26.65 13.37,24.28 16.21,24.28
VBUS
  Top 0.254: SJ1.2 31.31,41.79 30.43,42.67 29.62,42.67 29.11,43.18 27.89,43.18 25.8,41.09 X2.VBUS
  Top 0.406: JP1.2 32.55,41.64 32.46,41.55 | SJ1.2 31.37,41.55 32.46,41.55 | SJ2.2 32.51,41.5 32.46,41.55

### Text on the board
tPlace: MAX32664 | 2K2 | UHS mini | VBUS-3.3V | VBUS-5V | 0.1 | Circuits@Home | Aug.24,2010 | GI | 0.1 | r1.0 | U7 | D9 | 3.3V | TX | RX | GND | GO | SCL | SDA | 3.3V | GND | RXI | TXO | !CTS | RESET | 5V | 5V IN | CCH1 | CCH2
bPlace: GND | DESIGNED IN SPAIN BY MAKERS | OPEN IoT / OXYMETER | RCH2 | RCH1 | D8 | D1 | http://coronavirusmakers.org | RCH2 | Battery / Babysitter | USB MINI B | Serial Basic | TXO | + - S | RXI | GRN | VCC | C22 | R17 | BLK | !PGD! | C17 | !DTR | L1 | R18 | !CTS | OFF
tValues: Close
Document: Released under Creative Commons Attribution-NonCommercial-ShareAlike License | http://creativecommons.org/licenses/by-nc-sa/3.0/